# Altium schematic sheet Schemtaic.SchDoc
size A4; SheetNumber: 1; SheetTotal: 1
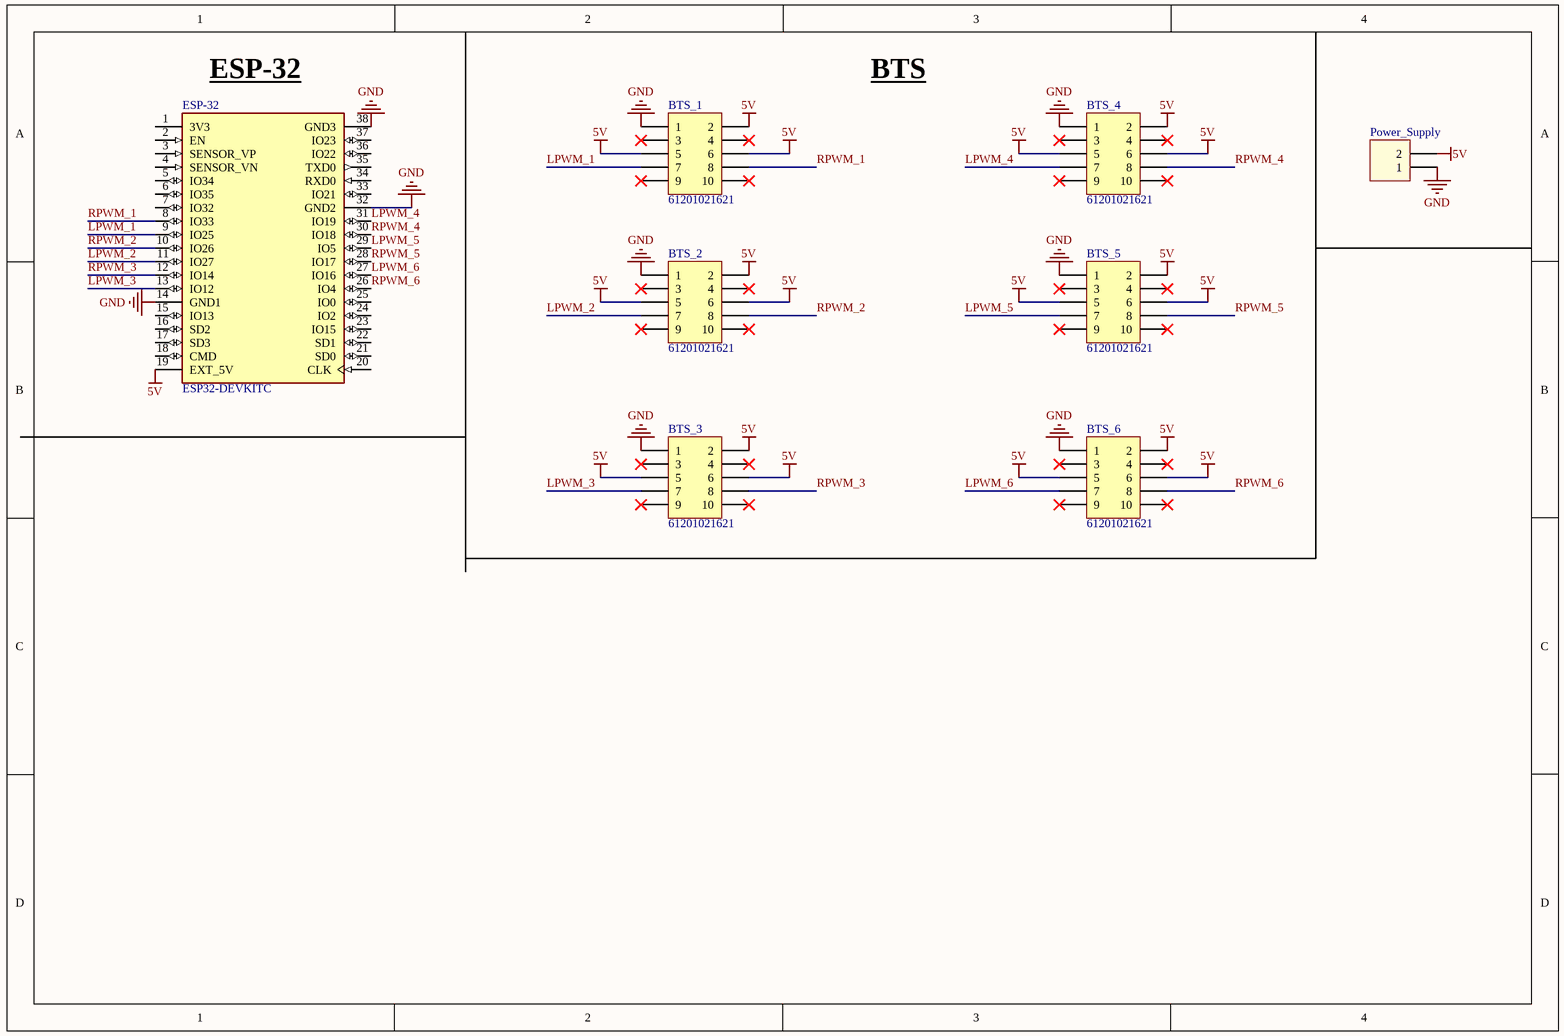
[diagram p0: Schemtaic.SchDoc]

## Parts
BTS_1  61201021621  [61201021621]
BTS_2  61201021621  [61201021621]
BTS_3  61201021621  [61201021621]
BTS_4  61201021621  [61201021621]
BTS_5  61201021621  [61201021621]
BTS_6  61201021621  [61201021621]
ESP-32  ESP32-DEVKITC  [MODULE_ESP32-DEVKITC]
Power_Supply  691311700102  [691311700102]  (value not drawn)

## Nets
5V: BTS_1.2 BTS_1.5 BTS_1.6 BTS_2.2 BTS_2.5 BTS_2.6 BTS_3.2 BTS_3.5 BTS_3.6 BTS_4.2 BTS_4.5 BTS_4.6 BTS_5.2 BTS_5.5 BTS_5.6 BTS_6.2 BTS_6.5 BTS_6.6 ESP-32.19(EXT_5V) Power_Supply.2
GND: BTS_1.1 BTS_2.1 BTS_3.1 BTS_4.1 BTS_5.1 BTS_6.1 ESP-32.14(GND1) ESP-32.32(GND2) ESP-32.38(GND3) Power_Supply.1
LPWM_1: BTS_1.7 ESP-32.9(IO25)
LPWM_2: BTS_2.7 ESP-32.11(IO27)
LPWM_3: BTS_3.7 ESP-32.13(IO12)
LPWM_4: BTS_4.7 ESP-32.31(IO19)
LPWM_5: BTS_5.7 ESP-32.29(IO5)
LPWM_6: BTS_6.7 ESP-32.27(IO16)
RPWM_1: BTS_1.8 ESP-32.8(IO33)
RPWM_2: BTS_2.8 ESP-32.10(IO26)
RPWM_3: BTS_3.8 ESP-32.12(IO14)
RPWM_4: BTS_4.8 ESP-32.30(IO18)
RPWM_5: BTS_5.8 ESP-32.28(IO17)
RPWM_6: BTS_6.8 ESP-32.26(IO4)

Not connected (* = marked no-connect by the designer): BTS_1 3* 4* 9* 10*; BTS_2 3* 4* 9* 10*; BTS_3 3* 4* 9* 10*; BTS_4 3* 4* 9* 10*; BTS_5 3* 4* 9* 10*; BTS_6 3* 4* 9* 10*; ESP-32 1(3V3) 2(EN) 3(SENSOR_VP) 4(SENSOR_VN) 5(IO34) 6(IO35) 7(IO32) 15(IO13) 16(SD2) 17(SD3) 18(CMD) 20(CLK) 21(SD0) 22(SD1) 23(IO15) 24(IO2) 25(IO0) 33(IO21) 34(RXD0) 35(TXD0) 36(IO22) 37(IO23)

## Notes on the sheet
- (near ESP-32) ESP-32
- BTS

## Library data of the parts
BTS_1-BTS_6 = 61201021621: WR-BHD 2.54mm Male Box Header; Manufacturer: Wurth Elektronik; ComponentLink1 Description: Manufacturer; ComponentLink2 Description: Datasheet; NoPins: 10; Created Date: March 2016; partNo: 61201021621; ComponentLink1URL: http://www.we-online.com; ComponentLink2URL: http://katalog.we-online.de/em/datasheet/6120xx21621.pdf; Created by: Baojun Chen
ESP-32 = ESP32-DEVKITC: ESP32-WROOM-32UE series Transceiver; 802.11 b/g/n (Wi-Fi, WiFi, WLAN), Bluetooth Â® Smart Ready 4.x Dual Mode Evaluation Board; MF: Espressif Systems; Value: *; SnapEDA_Link: https://www.snapeda.com/parts/ESP32-DEVKITC/Espressif+Systems/view-part/?ref=snap; MP: ESP32-DEVKITC; Purchase-URL: https://pricing.snapeda.com/search/part/ESP32-DEVKITC/?ref=eda; Check_prices: https://www.snapeda.com/parts/ESP32-DEVKITC/Espressif+Systems/view-part/?ref=eda; Availability: In Stock; Price: None; Package: None
Power_Supply = 691311700102: WR-TBL Serie 3117 - 5.00 mm Close Vertical PCB Header, 02p; Pitch: 5 mm; Published Date: Jan 2017; Publisher: Wurth Elektronik; ComponentLink1Description: Manufacturer; ComponentLink1URL: http://www.we-online.de; ComponentLink2Description: Datasheet; ComponentLink2URL: http://katalog.we-online.de/em/datasheet/6913117001xx.pdf; Part Number: 691311700102; Pin Number: 02p